# EAGLE design VFD-IV-25-5x7x2_t2 (EAGLE 7.2.0)
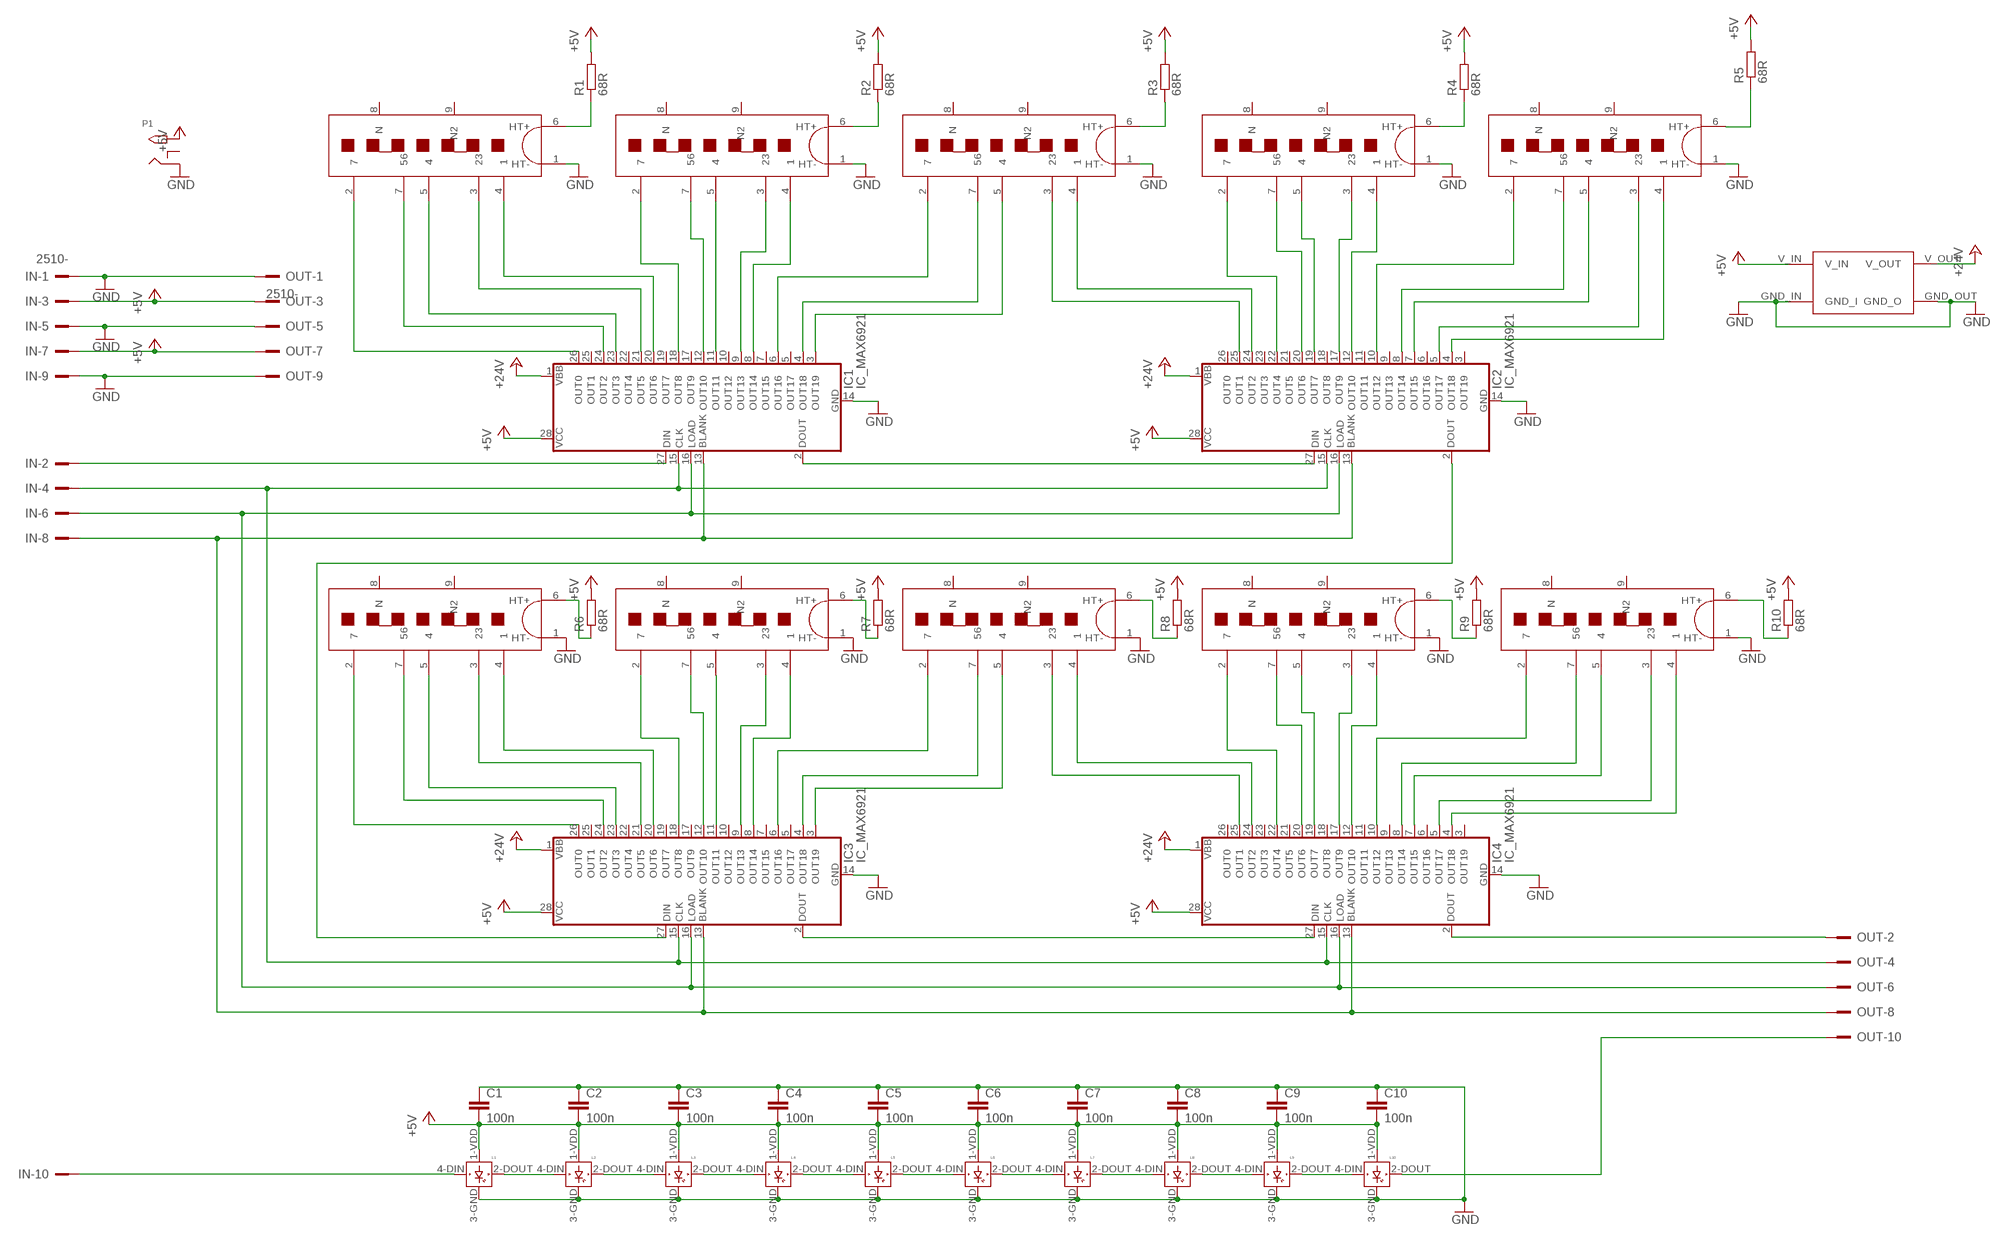
[diagram p0: schematic, sheet 1]

## Parts
1  IV-25_DISP_T3  [IV-25]
2  IV-25_DISP_T3  [IV-25]
3  IV-25_DISP_T3  [IV-25]
4  IV-25_DISP_T3  [IV-25]
5  IV-25_DISP_T3  [IV-25]
6  IV-25_DISP_T3  [IV-25]
7  IV-25_DISP_T3  [IV-25]
8  IV-25_DISP_T3  [IV-25]
9  IV-25_DISP_T3  [IV-25]
10  IV-25_DISP_T3  [IV-25]
C1  100n  C-EU050-025X075  [C050-025X075]
C2  100n  C-EU050-025X075  [C050-025X075]
C3  100n  C-EU050-025X075  [C050-025X075]
C4  100n  C-EU050-025X075  [C050-025X075]
C5  100n  C-EU050-025X075  [C050-025X075]
C6  100n  C-EU050-025X075  [C050-025X075]
C7  100n  C-EU050-025X075  [C050-025X075]
C8  100n  C-EU050-025X075  [C050-025X075]
C9  100n  C-EU050-025X075  [C050-025X075]
C10  100n  C-EU050-025X075  [C050-025X075]
IC1  IC_MAX6921  [S28]
IC2  IC_MAX6921  [S28]
IC3  IC_MAX6921  [S28]
IC4  IC_MAX6921  [S28]
IN  2510-  [PAK100/2500-10]
L1  WS2812B  [WS2812B]
L2  WS2812B  [WS2812B]
L3  WS2812B  [WS2812B]
L4  WS2812B  [WS2812B]
L5  WS2812B  [WS2812B]
L6  WS2812B  [WS2812B]
L7  WS2812B  [WS2812B]
L8  WS2812B  [WS2812B]
L9  WS2812B  [WS2812B]
L10  WS2812B  [WS2812B]
OUT  2510-  [PAK100/2500-10]
P1  2.1MMJACKTHM  [PJ-102A]
R1  68R  R-EU_0207/10  [0207/10]
R2  68R  R-EU_0207/10  [0207/10]
R3  68R  R-EU_0207/10  [0207/10]
R4  68R  R-EU_0207/10  [0207/10]
R5  68R  R-EU_0207/10  [0207/10]
R6  68R  R-EU_0207/10  [0207/10]
R7  68R  R-EU_0207/10  [0207/10]
R8  68R  R-EU_0207/10  [0207/10]
R9  68R  R-EU_0207/10  [0207/10]
R10  68R  R-EU_0207/10  [0207/10]
U$11  STEP_UP_MODULE  [STEP_UP_MODULE]

## Nets
+5V [power]: C1.2 C2.2 C3.2 C4.2 C5.2 C6.2 C7.2 C8.2 C9.2 C10.2 IC1.28(VCC) IC2.28(VCC) IC3.28(VCC) IC4.28(VCC) IN.3 IN.7 L1.1-VDD(VDD) L2.1-VDD(VDD) L3.1-VDD(VDD) L4.1-VDD(VDD) L5.1-VDD(VDD) L6.1-VDD(VDD) L7.1-VDD(VDD) L8.1-VDD(VDD) L9.1-VDD(VDD) L10.1-VDD(VDD) OUT.3 OUT.7 P1.TIP R1.2 R2.2 R3.2 R4.2 R5.2 R6.2 R7.2 R8.2 R9.2 R10.2 U$11.V_IN
+24V [power_lo]: IC1.1(VBB) IC2.1(VBB) IC3.1(VBB) IC4.1(VBB) U$11.V_OUT
GND [power]: 1.1(HT-) 2.1(HT-) 3.1(HT-) 4.1(HT-) 5.1(HT-) 6.1(HT-) 7.1(HT-) 8.1(HT-) 9.1(HT-) 10.1(HT-) C1.1 C2.1 C3.1 C4.1 C5.1 C6.1 C7.1 C8.1 C9.1 C10.1 IC1.14(GND) IC2.14(GND) IC3.14(GND) IC4.14(GND) IN.1 IN.5 IN.9 L1.3-GND(GND) L2.3-GND(GND) L3.3-GND(GND) L4.3-GND(GND) L5.3-GND(GND) L6.3-GND(GND) L7.3-GND(GND) L8.3-GND(GND) L9.3-GND(GND) L10.3-GND(GND) OUT.1 OUT.5 OUT.9 P1.RING U$11.GND_IN(GND_I) U$11.GND_OUT(GND_O)
N$1: L1.2-DOUT(DOUT) L2.4-DIN(DIN)
N$2: L2.2-DOUT(DOUT) L3.4-DIN(DIN)
N$3: L3.2-DOUT(DOUT) L4.4-DIN(DIN)
N$4: L4.2-DOUT(DOUT) L5.4-DIN(DIN)
N$5: L5.2-DOUT(DOUT) L6.4-DIN(DIN)
N$6: L6.2-DOUT(DOUT) L7.4-DIN(DIN)
N$7: L7.2-DOUT(DOUT) L8.4-DIN(DIN)
N$8: L8.2-DOUT(DOUT) L9.4-DIN(DIN)
N$9: L9.2-DOUT(DOUT) L10.4-DIN(DIN)
N$10: 1.2 IC1.26(OUT0)
N$12: 1.7 IC1.24(OUT2)
N$13: 1.5 IC1.23(OUT3)
N$15: 1.3 IC1.21(OUT5)
N$16: 1.4 IC1.20(OUT6)
N$17: 2.2 IC1.18(OUT8)
N$19: 2.7 IC1.12(OUT10)
N$20: 2.5 IC1.11(OUT11)
N$22: 2.3 IC1.9(OUT13)
N$23: 2.4 IC1.8(OUT14)
N$24: 3.2 IC1.6(OUT16)
N$26: 4.2 IC2.22(OUT4)
N$28: 3.7 IC1.4(OUT18)
N$29: 3.5 IC1.3(OUT19)
N$31: 3.3 IC2.25(OUT1)
N$32: 3.4 IC2.24(OUT2)
N$33: 4.7 IC2.20(OUT6)
N$34: 4.5 IC2.19(OUT7)
N$36: 4.3 IC2.17(OUT9)
N$37: 4.4 IC2.12(OUT10)
N$38: 5.2 IC2.10(OUT12)
N$40: 5.7 IC2.8(OUT14)
N$41: 5.5 IC2.7(OUT15)
N$43: 5.3 IC2.5(OUT17)
N$44: 5.4 IC2.4(OUT18)
N$45: 6.2 IC3.26(OUT0)
N$47: 6.7 IC3.24(OUT2)
N$48: 6.5 IC3.23(OUT3)
N$50: 6.3 IC3.21(OUT5)
N$51: 6.4 IC3.20(OUT6)
N$52: 7.2 IC3.18(OUT8)
N$54: 7.7 IC3.12(OUT10)
N$55: 7.5 IC3.11(OUT11)
N$57: 7.3 IC3.9(OUT13)
N$58: 7.4 IC3.8(OUT14)
N$59: 8.2 IC3.6(OUT16)
N$61: 8.7 IC3.4(OUT18)
N$62: 8.5 IC3.3(OUT19)
N$64: 8.3 IC4.25(OUT1)
N$65: 8.4 IC4.24(OUT2)
N$66: 9.2 IC4.22(OUT4)
N$68: 9.7 IC4.20(OUT6)
N$69: 9.5 IC4.19(OUT7)
N$71: 9.3 IC4.17(OUT9)
N$72: 9.4 IC4.12(OUT10)
N$73: 10.2 IC4.10(OUT12)
N$75: 10.7 IC4.8(OUT14)
N$76: 10.5 IC4.7(OUT15)
N$78: 10.3 IC4.5(OUT17)
N$79: 10.4 IC4.4(OUT18)
N$80: IC1.2(DOUT) IC2.27(DIN)
N$81: IC2.2(DOUT) IC3.27(DIN)
N$82: IC3.2(DOUT) IC4.27(DIN)
N$83: IC1.27(DIN) IN.2
N$84: IN.10 L1.4-DIN(DIN)
N$85: L10.2-DOUT(DOUT) OUT.10
N$86: IC4.2(DOUT) OUT.2
N$87: IC1.15(CLK) IC2.15(CLK) IC3.15(CLK) IC4.15(CLK) IN.4 OUT.4
N$88: IC1.16(LOAD) IC2.16(LOAD) IC3.16(LOAD) IC4.16(LOAD) IN.6 OUT.6
N$89 [power_lo]: 5.6(HT+) R5.1
N$90: IC1.13(BLANK) IC2.13(BLANK) IC3.13(BLANK) IC4.13(BLANK) IN.8 OUT.8
N$91 [power_lo]: 4.6(HT+) R4.1
N$92 [power_lo]: 3.6(HT+) R3.1
N$93 [power_lo]: 2.6(HT+) R2.1
N$94 [power_lo]: 1.6(HT+) R1.1
N$95 [power_lo]: 9.6(HT+) R9.1
N$96 [power_lo]: 10.6(HT+) R10.1
N$97 [power_lo]: 8.6(HT+) R8.1
N$98 [power_lo]: 7.6(HT+) R7.1
N$99 [power_lo]: 6.6(HT+) R6.1
Unconnected: 1.8(N) 1.9(N2) 2.8(N) 2.9(N2) 3.8(N) 3.9(N2) 4.8(N) 4.9(N2) 5.8(N) 5.9(N2) 6.8(N) 6.9(N2) 7.8(N) 7.9(N2) 8.8(N) 8.9(N2) 9.8(N) 9.9(N2) 10.8(N) 10.9(N2) IC1.5(OUT17) IC1.7(OUT15) IC1.10(OUT12) IC1.17(OUT9) IC1.19(OUT7) IC1.22(OUT4) IC1.25(OUT1) IC2.3(OUT19) IC2.6(OUT16) IC2.9(OUT13) IC2.11(OUT11) IC2.18(OUT8) IC2.21(OUT5) IC2.23(OUT3) IC2.26(OUT0) IC3.5(OUT17) IC3.7(OUT15) IC3.10(OUT12) IC3.17(OUT9) IC3.19(OUT7) IC3.22(OUT4) IC3.25(OUT1) IC4.3(OUT19) IC4.6(OUT16) IC4.9(OUT13) IC4.11(OUT11) IC4.18(OUT8) IC4.21(OUT5) IC4.23(OUT3) IC4.26(OUT0) P1.RING_SW

## Library data of the parts
1-10 = vfd:IV-25_DISP_T3
C1-C10 = resistor:C-EU: CAPACITOR, European symbol
IC1-IC4 = rob:IC_MAX6921: 20-outputs, 76V, serial VFD driver Dangerousprototypes.com
IN OUT = con-3m:2510-: 3M (TM) Pak 100 4-Wall Header Source: 3M; MF: 3M; MPN: 2510-6002UB; OC_FARNELL: 9838244; OC_NEWARK: 46F4725
L1-L10 = adafruit:WS2812B
P1 = adafruit:2.1MMJACK: 2.1mm x 5.5mm THM DC jack with internal switch. Digikey part #PJ-102A, 4UCON part #05537 2.1mm x 5.5mm SMT DC jack with internal switch. Digikey part #PJ-002A-SMT, 4UCON part #03267 By microbuilder.eu & adafruit.com
R1-R10 = resistor:R-EU_: RESISTOR, European symbol
U$11 = vfd:STEP_UP_MODULE

## Net classes
1 power: width 1 mm
2 power_lo: width 0.5 mm

## Board
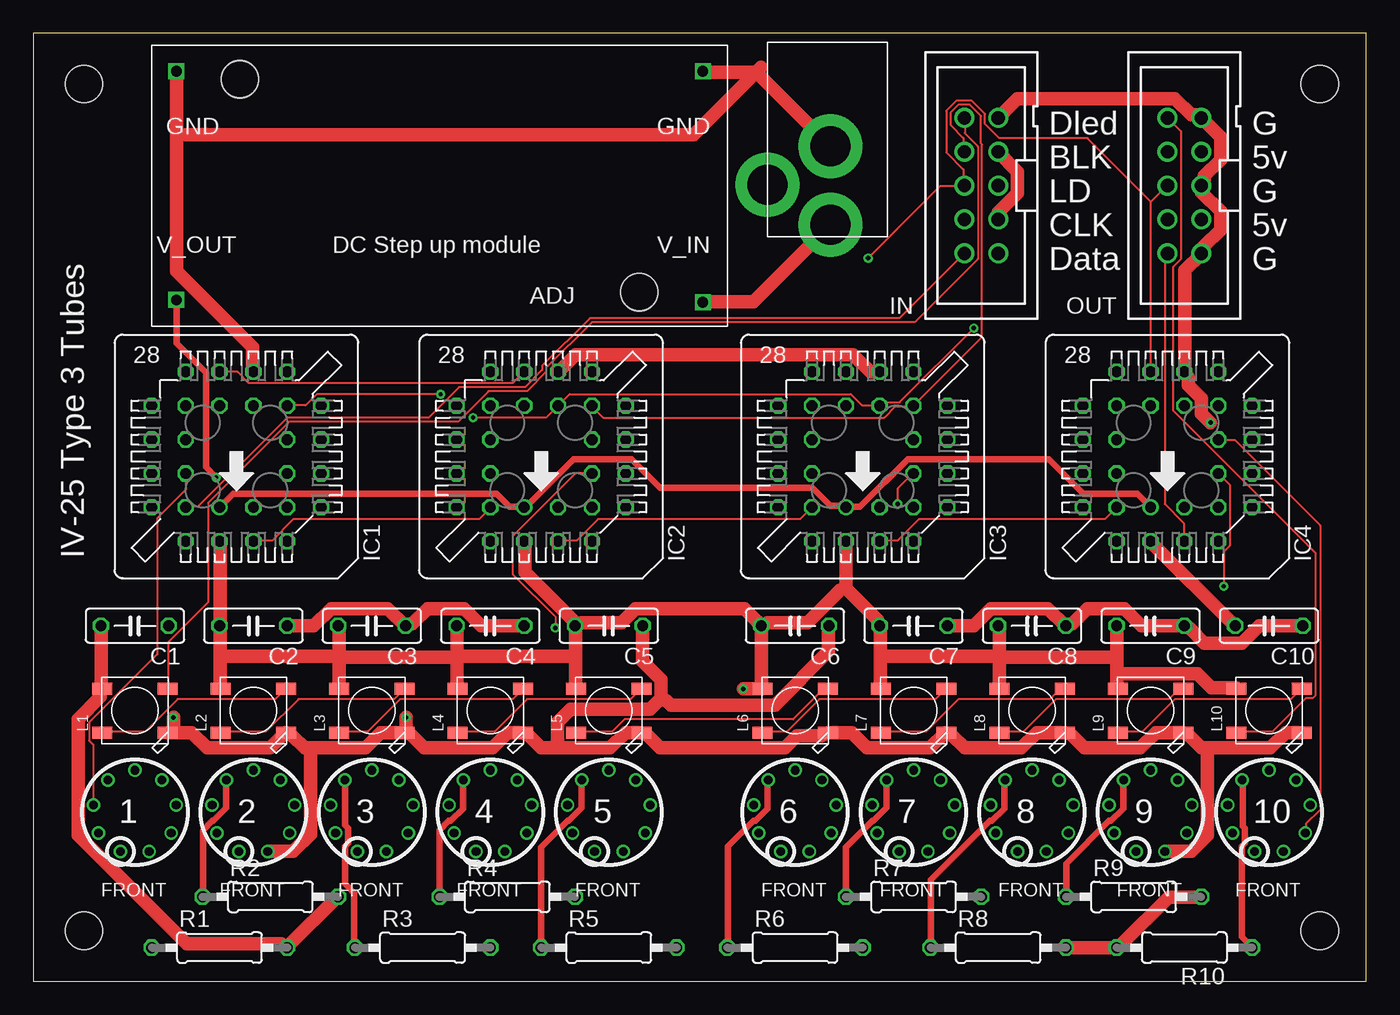
[diagram p1: board, top side]
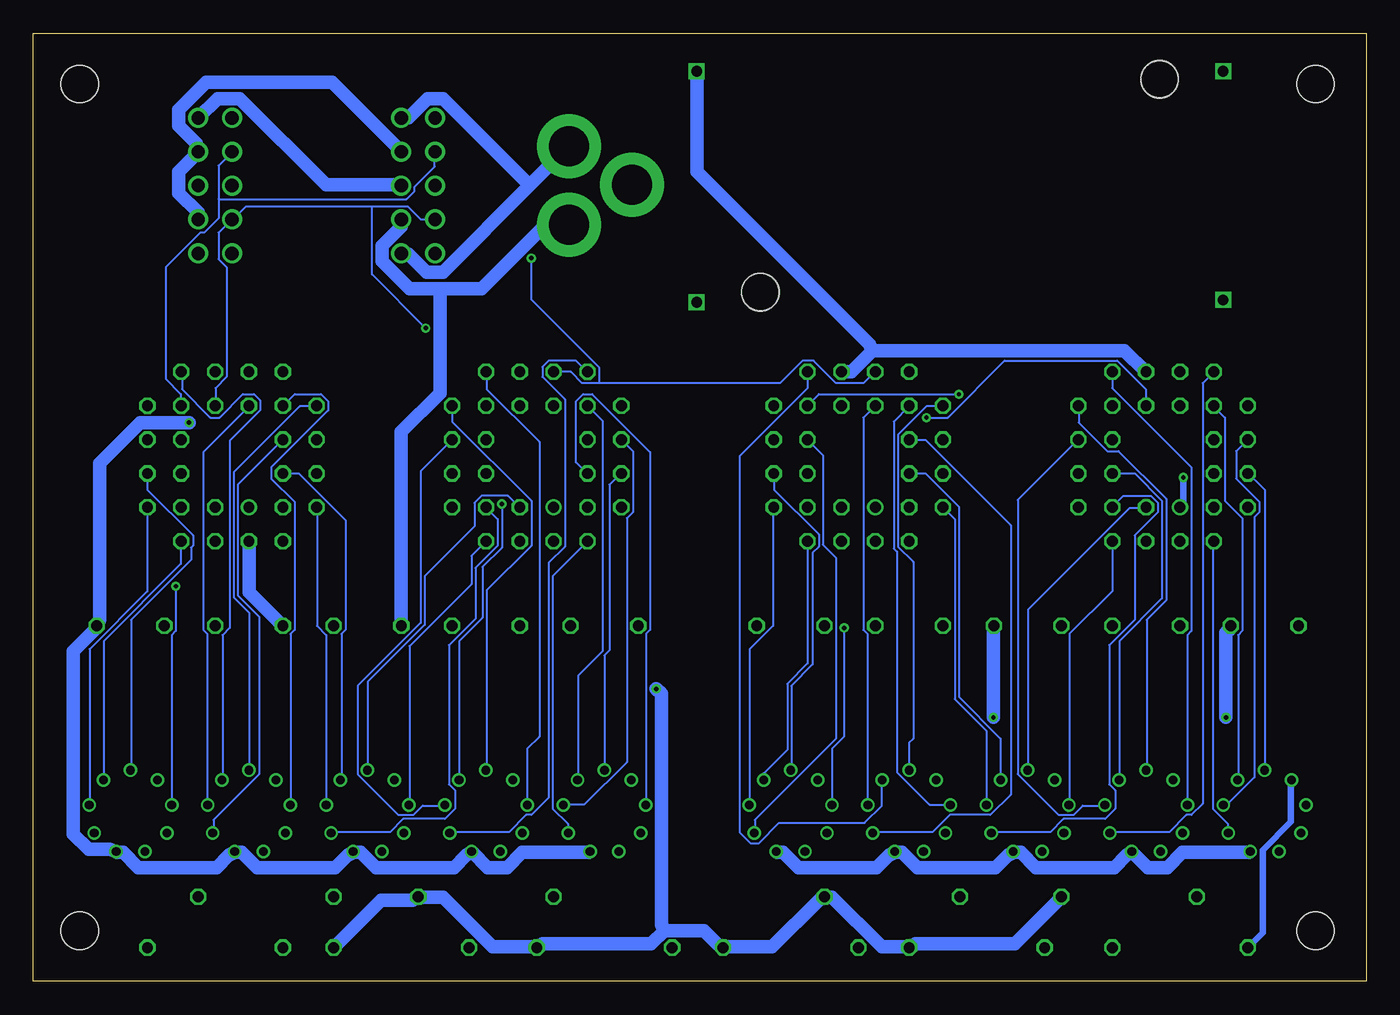
[diagram p2: board, bottom side, seen from below]

Size 100 x 71.11 mm. Coordinates in mm from the lower left corner, seen from the top.
Outline: 0,0 100,0 100,71.11 0,71.11 0,0
Copper layers (1*16): Top 0.0356mm / dielectric 1.5011mm / Bottom 0.0356mm
Design rules "oshpark-2layer": minimum track width 6mil, minimum drill 13mil, track to track 6mil, track to pad 6mil, pad to pad 6mil, via to via 6mil, smd to smd 6mil, copper to edge 15mil, drill to drill 6mil, minimum pad ring 7mil, minimum via ring 7mil, stop-mask expansion 4mil, vias tented up to drill 0mil, thermal gap 10mil
Holes 2.8 mm at 45.45,51.7 3.81,67.31 15.49,67.66 96.52,67.31 96.52,3.81 3.81,3.81

### Footprints (pad centres in the part's own frame; a part is rotated, then mirrored left to right if it is on the bottom)
IV-25 = drill 0.65: 1 1.076,-2.955; 2 2.724,-1.572; 3 3.097,0.546; 4 2.022,2.409; 5 0,3.145; 6 -2.022,2.409; 7 -3.097,0.546; 8 -2.724,-1.572; 9 -1.076,-2.955
C050-025X075 = drill 0.813 octagon: 1 -2.54,0; 2 2.54,0
S28 = drill 0.813: 1 1.27,3.81 | drill 0.813 octagon: 2 -1.27,6.35; 3 -1.27,3.81; 4 -3.81,6.35; 5 -6.35,3.81; 6 -3.81,3.81; 7 -6.35,1.27; 8 -3.81,1.27; 9 -6.35,-1.27; 10 -3.81,-1.27; 11 -6.35,-3.81; 12 -3.81,-6.35; 13 -3.81,-3.81; 14 -1.27,-6.35; 15 -1.27,-3.81; 16 1.27,-6.35; 17 1.27,-3.81; 18 3.81,-6.35; 19 6.35,-3.81; 20 3.81,-3.81; 21 6.35,-1.27; 22 3.81,-1.27; 23 6.35,1.27; 24 3.81,1.27; 25 6.35,3.81; 26 3.81,6.35; 27 3.81,3.81; 28 1.27,6.35
PAK100/2500-10 = drill 1 pad 1.422: 1 -5.08,-1.27; 2 -5.08,1.27; 3 -2.54,-1.27; 4 -2.54,1.27; 5 0,-1.27; 6 0,1.27; 7 2.54,-1.27; 8 2.54,1.27; 9 5.08,-1.27; 10 5.08,1.27
WS2812B = smd 1.5 x 0.9: 1-VDD 2.45,-1.65; 2-DOUT 2.45,1.65; 3-GND -2.45,1.65; 4-DIN -2.45,-1.65
PJ-102A = drill 3 pad 4.8: RING 0.1,-3.39; RING_SW -4.6,-6.29; TIP 0.1,-9.29
0207/10 = drill 0.813 octagon: 1 -5.08,0; 2 5.08,0
STEP_UP_MODULE = drill 0.8 square: GND_IN -19.749,-8.573; GND_OUT 19.749,-8.573; V_IN -19.749,8.753; V_OUT 19.749,8.573 | hole 2.8: -14.986,8.001; 14.986,-8.001

### Placement (x,y rotation side)
1  7.62,12.7 0 top
2  16.51,12.7 0 top
3  25.4,12.7 0 top
4  34.29,12.7 0 top
5  43.18,12.7 0 top
6  57.15,12.7 0 top
7  66.04,12.7 0 top
8  74.93,12.7 0 top
9  83.82,12.7 0 top
10  92.71,12.7 0 top
C1  7.62,26.67 180 top
C2  16.51,26.67 180 top
C3  25.4,26.67 180 top
C4  34.29,26.67 180 top
C5  43.18,26.67 180 top
C6  57.15,26.67 180 top
C7  66.04,26.67 180 top
C8  74.93,26.67 180 top
C9  83.82,26.67 180 top
C10  92.71,26.67 180 top
IC1  15.24,39.37 180 top
IC2  38.1,39.37 180 top
IC3  62.23,39.37 180 top
IC4  85.09,39.37 180 top
IN  71.12,59.69 90 top
L1  7.62,20.32 180 top
L2  16.51,20.32 180 top
L3  25.4,20.32 180 top
L4  34.29,20.32 180 top
L5  43.18,20.32 180 top
L6  57.15,20.32 180 top
L7  66.04,20.32 180 top
L8  74.93,20.32 180 top
L9  83.82,20.32 180 top
L10  92.71,20.32 180 top
OUT  86.36,59.69 90 top
P1  59.69,66.04 0 top
R1  13.97,2.54 0 top
R2  17.78,6.35 0 top
R3  29.21,2.54 0 top
R4  35.56,6.35 0 top
R5  43.18,2.54 0 top
R6  57.15,2.54 0 top
R7  66.04,6.35 0 top
R8  72.39,2.54 0 top
R9  82.55,6.35 0 top
R10  86.36,2.54 180 top
U$11  30.48,59.69 180 top

### Tracks (layer width: path | path; a pad name or v marks a point on that pad's centre or on a via)
+5V  (via drill 0.33)
  Top 1: R8.2 77.5,2.52 81.23,2.52 R10.2 81.69,2.82 85.19,6.33 87.63,6.33 R9.2 | C1.2 5.11,26.67 5.11,22.02 L1.1-VDD 5.03,21.49 5.03,21.34 3.35,19.66 3.35,10.97 11.51,2.82 18.59,2.82 R1.2 19.05,2.59 22.86,6.4 R2.2 | IN.3 72.39,57.68 73.84,59.13 73.84,60.73 72.39,62.18 IN.7 | U$11.V_IN 50.29,50.98 54.03,50.98 59.74,56.69 P1.TIP | 40.69,24.38 40.69,26.67 C5.2 | 40.69,24.38 40.69,22.02 L5.1-VDD | IC2.28 36.88,32.99 36.88,30.71 40.46,27.13 C5.2 | 14.02,24.38 14.02,26.67 C2.2 14.02,27.13 14.02,32.99 IC1.28 | 14.02,24.38 14.02,22.02 L2.1-VDD | 22.94,24.38 22.94,26.59 C3.2 | 22.94,24.38 22.94,24.31 | 22.94,24.31 22.94,22.02 L3.1-VDD | 31.77,24.38 31.77,26.67 C4.2 | 31.77,24.38 31.77,24.31 | 31.77,24.31 31.77,22.02 L4.1-VDD | 31.77,24.31 22.94,24.31 | 22.94,24.38 14.02,24.38 | 31.77,24.38 40.69,24.38 | C6.2 54.63,26.67 54.63,22.02 L6.1-VDD 54.18,21.95 v53.26,21.95 | 63.55,24.38 63.55,26.67 C7.2 63.32,27.13 60.96,29.49 | 63.55,24.38 63.55,22.02 L7.1-VDD | 60.96,29.49 IC3.28 | C6.2 55.09,26.9 58.06,26.9 60.5,29.34 60.96,29.49 | 72.47,24.38 72.47,26.59 C8.2 | 72.47,24.38 72.47,24.31 | 72.47,24.31 72.47,22.02 L8.1-VDD | 81.31,24.31 81.31,26.67 C9.2 | 81.31,24.31 81.31,23.09 | 81.31,23.09 81.31,22.02 L9.1-VDD | 81.31,23.09 87.33,23.09 88.39,22.02 90.22,22.02 L10.1-VDD | C10.2 90.14,26.67 83.82,32.99 IC4.28 | 81.31,24.31 72.47,24.31 | 72.47,24.38 63.55,24.38 | C5.2 41.15,26.9 44.12,26.9 45.19,27.96 53.34,27.96 54.25,27.05 C6.2
  Bottom 1: R8.2 73.91,6.1 71.55,6.1 R7.2 71.09,6.33 69.27,6.33 65.53,2.59 62.26,2.59 R6.2 61.8,2.82 53.65,2.82 52.65,3.81 | R2.2 22.86,6.33 26.36,2.82 33.83,2.82 R3.2 34.29,2.59 36.35,2.59 40.08,6.33 40.62,6.33 R4.2 41.07,6.1 44.58,2.59 48.23,2.59 R5.2 48.69,2.82 49.68,3.81 52.65,3.81 | OUT.3 87.63,57.68 89.08,59.13 89.08,60.73 87.63,62.18 OUT.7 87.78,62.71 87.78,62.87 89.08,64.16 89.08,65.38 87.02,67.44 77.57,67.44 72.39,62.26 IN.7 | IN.3 72.39,56.62 73.84,55.17 73.84,54.03 71.78,51.97 69.49,51.97 | 69.49,51.97 66.37,51.97 61.65,56.69 59.82,56.69 P1.TIP | IC4.28 83.82,29.18 81.31,26.67 C9.2 | 69.49,51.97 69.49,44.12 72.39,41.22 C8.2 | v53.26,21.95 52.88,21.57 52.88,4.27 52.65,3.81
+24V  (via drill 0.33)
  Top 0.5: IC4.1 83.82,35.59 82.83,36.58 78.79,36.58 76.2,39.17 65.61,39.17 62.03,35.59 60.96,35.59 IC3.1 60.73,35.66 59.82,35.66 58.45,37.03 47.02,37.03 44.88,39.17 40.54,39.17 37.03,35.66 IC2.1 36.8,35.59 35.74,35.59 34.75,36.58 15.01,36.58 14.02,35.59 IC1.1 | v13.72,37.8 12.95,38.56 12.95,45.64 10.74,47.85 10.74,51.05 U$11.V_OUT
  Bottom 0.5: v13.72,37.8 13.72,35.81 IC1.1
GND  (via drill 0.33)
  Top 1: U$11.GND_IN 50.29,68.2 54.25,68.2 59.74,62.71 P1.RING | IN.9 73.84,66.22 85.65,66.22 86.87,65 87.17,65 OUT.9 89.08,63.32 89.08,61.65 87.86,60.43 87.86,60.12 OUT.5 87.63,59.21 89.08,57.76 89.08,56.39 87.78,55.09 OUT.1 87.63,54.56 86.41,53.34 86.41,45.72 IC4.14 86.64,45.26 86.64,44.73 87.63,43.74 87.63,42.6 v88.32,41.91 | U$11.GND_OUT 10.74,68.2 10.74,53.26 16.46,47.55 16.46,45.72 IC1.14 | IC3.14 62.79,45.72 61.49,47.02 40.69,47.02 39.4,45.72 IC2.14 | 88.09,17.53 87.63,17.53 86.72,18.44 L9.3-GND 86.26,18.67 84.2,18.67 83.06,17.53 78.87,17.53 77.88,18.52 L8.3-GND 77.34,18.67 75.29,18.67 74.14,17.53 69.88,17.53 68.96,18.44 L7.3-GND 68.43,18.67 67.28,17.53 62.56,17.53 61.42,18.67 59.66,18.67 L6.3-GND 59.13,18.44 57.3,18.44 56.39,17.53 47.02,17.53 46.1,18.44 L5.3-GND 45.57,18.67 44.42,18.67 43.28,17.53 39.32,17.53 | 88.09,17.53 92.81,17.53 93.95,18.67 95.1,18.67 L10.3-GND | C7.1 70.56,26.67 71.86,27.96 76.12,27.96 77.42,26.67 C8.1 77.95,26.82 79.1,27.96 81.84,27.96 83.13,26.67 C9.1 86.79,26.44 87.86,25.38 90.68,25.38 91.97,26.67 C10.1 | 88.09,17.53 88.09,10.97 86.87,9.75 84.96,9.75 9.1 | C2.1 21.03,26.67 22.33,27.96 26.59,27.96 27.89,26.67 C3.1 28.42,26.82 29.57,27.96 32.31,27.96 33.6,26.67 C4.1 | 10.52,18.67 11.89,18.67 13.03,17.53 17.75,17.53 18.9,18.67 L2.3-GND 19.43,18.44 20.34,17.53 20.8,17.53 | 10.52,18.67 10.13,18.67 L1.3-GND | 27.81,18.67 26.06,18.67 24.92,17.53 20.8,17.53 | 27.81,18.67 L3.3-GND 28.35,18.52 29.34,17.53 34.44,17.53 35.59,18.67 36.73,18.67 L4.3-GND 37.19,18.44 38.1,17.53 39.32,17.53 | 10.52,18.67 v10.52,19.81
  Top 1: C5.1 45.72,24 47.09,22.63 47.09,21.26 | 47.09,21.26 46.25,20.42 40.31,20.42 39.32,19.43 39.32,17.53 | C6.1 59.66,26.67 59.66,24.77 55.63,20.73 47.85,20.73 47.55,21.03 47.09,21.26 | v27.96,19.81 27.96,19.13 27.81,18.67 | 20.8,17.53 20.8,11.05 19.51,9.75 17.6,9.75 2.1
  Bottom 1: OUT.9 86.18,66.22 84.51,66.22 78.03,59.74 72.39,59.74 IN.5 | 62.75,59.7 59.82,62.64 P1.RING | 62.75,59.7 69.27,53.19 70.48,53.19 71.86,54.56 72.39,54.56 IN.1 | IN.9 71.86,64.77 70.41,66.22 69.27,66.22 62.75,59.7 | IC2.14 38.63,45.72 37.03,47.32 | 37.03,47.32 18.14,47.32 16.54,45.72 IC1.14 | U$11.GND_IN 50.22,68.2 50.22,60.73 37.26,47.78 37.03,47.32 | 6.1 58.29,9.68 63.32,9.68 64.47,8.53 65.91,8.53 67.06,9.68 7.1 67.51,9.45 68.43,8.53 74.3,8.53 75.44,9.68 75.97,9.68 | 75.97,9.68 8.1 | 84.89,9.68 84.35,9.68 83.21,8.53 77.34,8.53 76.43,9.45 75.97,9.68 | 84.89,9.68 9.1 | 84.89,9.68 85.34,9.45 86.26,8.53 92.13,8.53 93.27,9.68 93.73,9.68 10.1 94.26,9.91 95.86,9.91 97,11.05 97,24.77 95.25,26.52 C10.1 95.02,27.13 95.02,38.86 91.97,41.91 v88.32,41.91 | 1.1 8.76,9.68 13.79,9.68 14.94,8.53 16.38,8.53 17.53,9.68 2.1 17.98,9.45 18.9,8.53 24.77,8.53 25.91,9.68 26.44,9.68 | 26.44,9.68 3.1 | 35.36,9.68 34.82,9.68 33.68,8.53 27.81,8.53 26.9,9.45 26.44,9.68 | 35.36,9.68 4.1 | 5.1 44.2,9.68 43.74,9.68 42.6,8.53 36.73,8.53 35.81,9.45 35.36,9.68 | v10.52,19.81 10.52,26.14 10.21,26.44 10.21,26.67 C1.1 | v27.96,19.81 27.96,26.67 C3.1
N$1
  Top 0.152: L1.2-DOUT 5.18,18.75 8.38,18.75 10.82,21.18 18.14,21.18 18.9,21.95 L2.4-DIN
N$2
  Top 0.152: L2.2-DOUT 14.1,18.75 17.45,18.75 19.89,21.18 27.05,21.18 27.81,21.95 L3.4-DIN
N$3
  Top 0.152: L3.2-DOUT 23.01,18.75 25.07,18.75 27.51,21.18 35.97,21.18 36.73,21.95 L4.4-DIN
N$4
  Top 0.152: L4.2-DOUT 31.85,18.75 34.59,18.75 37.03,21.18 44.81,21.18 45.57,21.95 L5.4-DIN
N$5
  Top 0.152: L5.2-DOUT 40.77,18.75 43.43,18.75 44.35,19.66 57,19.66 59.28,21.95 59.59,21.95 L6.4-DIN
N$6
  Top 0.152: L6.2-DOUT 54.71,18.75 56.54,18.75 58.98,21.18 67.67,21.18 68.43,21.95 L7.4-DIN
N$7
  Top 0.152: L7.2-DOUT 63.63,18.75 66.98,18.75 69.42,21.18 76.28,21.18 77.04,21.95 77.34,21.95 L8.4-DIN
N$8
  Top 0.152: L8.2-DOUT 72.54,18.75 74.3,18.75 76.73,21.18 85.19,21.18 85.95,21.95 86.26,21.95 L9.4-DIN
N$9
  Top 0.152: L9.2-DOUT 81.38,18.75 83.21,18.75 85.65,21.18 94.34,21.18 95.1,21.95 L10.4-DIN
N$10
  Bottom 0.152: 1.2 10.36,11.2 10.36,11.81 11.51,12.95 11.51,32.92 11.43,32.99 IC1.26
N$11
  Top 1.016: 11.43,63.5 49.53,63.5 54.61,68.58
N$12
  Top 0.152: IC1.24 11.43,36.88 9.3,34.75 9.3,24.54 4.19,19.43 4.19,18.06 4.5,17.75 4.5,13.26 1.7
N$13
  Bottom 0.152: 1.5 7.62,36.88 8.84,38.1 IC1.23
N$15
  Bottom 0.152: IC1.21 9.75,39.78 9.75,37.72 8,35.97 8,35.2 8.38,34.82 8.38,15.32 10.44,13.26 10.67,13.26 1.3
N$16
  Bottom 0.152: 1.4 9.6,15.16 9.6,25.98 9.3,26.29 9.3,34.75 10.59,36.04 10.59,42.29 11.43,43.13 IC1.20
N$17
  Bottom 0.152: IC1.18 12.27,44.88 12.27,13.34 13.11,12.5 13.49,12.5 14.78,11.2 19.2,11.2 2.2
N$19
  Bottom 0.152: IC1.12 19.05,44.5 13.11,38.56 13.11,26.29 13.41,25.98 2.7
N$20
  Bottom 0.152: 2.5 16.46,15.85 16.46,27.13 15.01,28.57 15.01,36.2 18.59,39.78 19.43,39.78 21.57,41.91 21.57,43.13 IC1.11
N$22
  Bottom 0.152: 2.3 19.66,13.18 21.26,13.18 21.95,12.5 23.09,12.5 26.14,15.54 26.14,36.12 21.64,40.62 IC1.9
N$23
  Bottom 0.152: IC1.8 17.37,38.1 15.32,36.04 15.32,28.73 18.52,25.53 18.52,15.16 2.4
N$24
  Bottom 0.152: 3.2 28.12,11.2 23.7,11.2 22.71,12.19 19.58,12.19 18.82,12.95 18.82,14.33 19.28,14.78 19.28,25.22 17.37,27.13 17.37,33.45 15.62,35.2 15.62,35.89 16.15,36.42 18.21,36.42 19.05,35.59 IC1.6
N$26
  Bottom 0.152: 4.2 36.96,11.2 32.54,11.2 31.24,12.5 28.19,12.5 26.67,14.02 26.67,34.21 33.07,40.62 34.29,40.62 IC2.22
N$28
  Bottom 0.152: IC1.4 19.05,29.26 22.25,26.06 22.25,13.26 3.7
N$29
  Bottom 0.152: 3.5 25.38,15.85 25.38,27.89 17.75,35.51 16.54,35.51 IC1.3
N$31
  Bottom 0.152: IC2.25 30.86,34.67 30.86,21.18 28.5,18.82 3.3
N$32
  Bottom 0.152: IC2.24 33.07,38.1 30.56,35.59 30.56,21.34 27.43,18.21 27.43,15.16 3.4
N$33
  Bottom 0.152: 4.7 31.24,13.26 32.77,13.26 35.2,15.7 35.2,32.23 35.43,32.46 35.43,41.99 34.29,43.13 IC2.20
N$34
  Bottom 0.152: 4.5 34.29,17.91 33.98,18.21 33.98,31.47 35.13,32.61 35.13,41 32.99,43.13 31.77,43.13 IC2.19
N$36
  Bottom 0.152: IC2.17 37.72,42.29 37.72,26.36 37.41,26.06 37.41,13.26 4.3
N$37
  Bottom 0.152: IC2.12 41.91,44.5 47.02,39.4 47.02,11.2 46.18,10.36 45.57,10.36 44.04,11.89 37.64,11.89 36.35,13.18 36.35,15.09 4.4
N$38
  Bottom 0.152: 5.2 45.87,11.2 45.87,12.12 39.78,18.21 39.78,31.77 40.77,32.77 40.77,39.47 41.91,40.62 IC2.10
N$40  (via drill 0.33)
  Top 0.152: v39.17,26.52 39.17,27.36 35.97,30.56 35.97,33.38 40.69,38.1 IC2.8
  Bottom 0.152: v39.17,26.52 39.17,18.36 40.08,17.45 5.7
N$41
  Bottom 0.152: 5.5 43.13,15.85 43.13,22.17 41.53,23.77 41.53,32.16 41.07,32.61 41.07,33.53 44.42,36.88 44.42,38.1 IC2.7
N$43
  Bottom 0.152: 5.3 46.25,13.26 46.25,24.92 44.5,26.67 44.5,35.51 IC2.5
N$44
  Bottom 0.152: IC2.4 41.91,23.85 43.43,22.33 43.43,17.37 45.19,15.62 45.19,15.16 5.4
N$45
  Bottom 0.152: IC3.26 61.04,30.4 61.04,12.95 59.89,11.81 59.89,11.2 6.2
N$47
  Bottom 0.152: 6.7 54.03,13.26 54.03,26.06 53.72,26.36 53.72,39.7 58.06,44.04 58.75,44.04 59.28,43.51 59.28,38.94 58.45,38.1 IC3.24
N$48
  Bottom 0.152: 6.5 57.15,24.46 56.77,24.84 56.77,37.26 55.93,38.1 IC3.23
N$50
  Bottom 0.152: IC3.21 55.02,39.78 55.02,35.2 55.47,34.75 55.47,16.46 58.67,13.26 60.2,13.26 6.3
N$51
  Bottom 0.152: IC3.20 57.3,42.06 57.3,24.77 59.13,22.94 59.13,15.16 6.4
N$52
  Bottom 0.152: 7.2 68.73,11.2 64.31,11.2 63.02,12.5 62.64,12.5 61.34,13.79 61.34,31.39 60.12,32.61 60.12,43.66 61.8,45.34 61.8,46.1 61.34,46.56 59.28,46.56 58.45,45.72 IC3.18
N$54
  Bottom 0.152: 7.7 62.94,17.45 62.03,18.36 62.03,40.46 65.99,44.42 65.99,45.72 IC3.12
N$55
  Bottom 0.152: IC3.11 68.58,41.99 62.64,36.04 62.64,32.69 65.99,29.34 65.99,15.85 7.5
N$57
  Bottom 0.152: 7.3 69.19,13.18 70.79,13.18 71.48,12.5 72.62,12.5 75.67,15.54 75.67,22.17 70.94,26.9 70.94,38.25 68.58,40.62 IC3.9
N$58  (via drill 0.33)
  Top 0.152: v64.85,35.81 64.85,36.96 65.99,38.1 IC3.8
  Bottom 0.152: v64.85,35.81 64.85,32.54 66.29,31.09 66.29,27.28 68.05,25.53 68.05,15.16 7.4
N$59
  Bottom 0.152: IC3.6 65.15,34.67 65.15,32.69 66.83,31.01 66.83,27.2 68.81,25.22 68.81,14.78 68.35,14.33 68.35,12.95 69.11,12.19 72.24,12.19 73.23,11.2 77.65,11.2 8.2
N$61
  Bottom 0.152: IC3.4 67.13,31.93 67.13,29.79 71.78,25.15 71.78,13.26 8.7
N$62
  Bottom 0.152: 8.5 74.91,15.85 74.91,22.48 70.64,26.75 70.64,30.4 66.9,34.14 66.9,35.89 66.37,36.42 64.39,36.42 63.55,35.59 IC3.3
N$64
  Bottom 0.152: 8.3 78.03,25.98 78.72,26.67 78.72,35.51 IC4.25
N$65
  Bottom 0.152: IC4.24 80.09,38.1 76.58,34.59 76.58,26.36 76.89,26.06 76.89,15.16 8.4
N$66
  Bottom 0.152: IC4.22 84.66,37.26 84.66,28.96 83.06,27.36 83.06,15.54 86.49,12.12 86.49,11.2 9.2
N$68
  Bottom 0.152: 9.7 80.7,13.26 80.7,26.06 80.39,26.36 80.39,35.97 82.14,37.72 82.14,38.56 77.88,42.82 77.88,43.51 78.41,44.04 80.39,44.04 81.23,43.2 IC4.20
N$69
  Bottom 0.152: 9.5 83.82,27.66 84.96,28.8 84.96,38.18 80.01,43.13 78.79,43.13 IC4.19
N$71
  Bottom 0.152: 9.3 86.94,13.26 86.94,26.06 87.25,26.36 87.25,39.7 83.82,43.13 IC4.17
N$72
  Bottom 0.152: 9.4 85.8,15.16 85.8,25.98 85.27,26.52 85.27,40.54 82.98,42.82 82.98,43.59 83.44,44.04 84.28,44.04 86.03,42.29 86.72,42.29 88.85,44.42 88.85,45.72 IC4.12
N$73
  Top 0.152: 10.2 95.48,11.2 95.48,11.81 96.55,12.88 96.55,34.21 90.14,40.62 88.92,40.62 IC4.10
N$75  (via drill 0.33)
  Top 0.152: v89.31,29.64 89.31,32.23 89.76,32.69 89.76,37.26 88.92,38.1 IC4.8
  Bottom 0.152: v89.31,29.64 89.31,26.29 89.61,25.98 10.7
N$76
  Bottom 0.152: IC4.7 91.44,36.88 88.01,33.45 88.01,32.69 88.16,32.54 88.16,31.62 92.66,27.13 92.66,15.85 10.5
N$78
  Bottom 0.152: IC4.5 91.44,29.26 95.78,24.92 95.78,13.26 10.3
N$79
  Bottom 0.152: 10.4 94.72,15.16 94.72,25.53 88.92,31.32 88.92,32.99 IC4.4
N$80
  Top 0.152: IC1.2 16.54,33.07 17.91,33.07 19.51,34.67 33.45,34.67 34.29,35.51 IC2.27
N$81
  Top 0.152: IC3.27 57.53,34.67 42.37,34.67 40.77,33.07 39.4,33.07 IC2.2
N$82
  Top 0.152: IC4.27 80.39,34.67 66.45,34.67 64.85,33.07 63.55,33.07 IC3.2
N$83
  Top 0.152: IN.2 65,49.76 41.76,49.76 38.18,46.18 38.18,45.87 36.88,44.58 31.93,44.58 29.64,42.29 19.05,42.29 12.34,35.59 11.43,35.59 IC1.27
N$84
  Top 0.152: L1.4-DIN 10.13,22.02 10.13,25.45 13.11,28.42 13.11,35.89 19.2,41.99 31.85,41.99 34.14,44.27 37.03,44.27 38.48,45.72 38.48,46.02 41.91,49.45 66.14,49.45 70.87,54.18 70.87,62.64 69.88,63.63 69.88,64.77 IN.10
N$85
  Top 0.152: L10.2-DOUT 90.3,18.75 92.96,18.75 95.48,21.26 96.01,21.26 96.16,21.41 96.16,32.16 85.5,42.82 85.5,53.57 86.11,54.18 86.11,63.78 85.11,64.77 OUT.10
N$86
  Top 0.152: OUT.2 84.89,54.41 84.89,35.81 86.33,34.37 86.33,33.07 IC4.2
N$87  (via drill 0.33)
  Top 0.152: v32.99,42.29 38.48,42.29 IC2.15 40.23,44.04 61.34,44.04 62.18,43.2 63.48,43.2 IC3.15 63.55,43.2 63.78,43.43 65,43.43 v70.56,49
  Bottom 0.152: IC4.15 86.33,43.2 86.33,44.5 85.5,45.34 85.5,53.57 86.11,54.18 86.11,56.16 85.11,57.15 OUT.4 85.04,57.15 84.05,58.14 74.6,58.14 | IN.4 70.94,57.15 71.93,58.14 74.6,58.14 | v32.99,42.29 31.39,42.29 27.13,46.56 18.67,46.56 16.54,44.42 16.54,43.2 IC1.15 | 74.6,58.14 74.6,53.03 v70.56,49
N$88  (via drill 0.33)
  Top 0.152: IC4.16 83.82,58.45 83.86,58.48 | 83.86,58.48 85.04,59.66 OUT.6 | 83.86,58.48 79.1,63.25 72.47,63.25 71.4,64.31 71.4,65.08 70.41,66.06 69.27,66.06 68.5,65.3 68.5,62.18 69.8,60.88 69.8,59.74 IN.6 69.8,59.66 68.05,59.66 v62.64,54.25 | IC1.16 15.32,45.72 16.15,44.88 35.97,44.88 36.8,45.72 IC2.16
  Bottom 0.152: IC3.16 59.66,45.72 58.83,44.88 57.53,44.88 | 57.53,44.88 43.97,44.88 42.29,46.56 41.45,46.56 39.78,44.88 37.72,44.88 36.88,45.72 IC2.16 | v62.64,54.25 62.64,51.13 57.53,46.02 57.53,44.88
N$89
  Top 0.5: R5.1 38.1,10.06 40.08,12.04 40.16,12.04 41.15,13.03 41.15,15.09 5.6
N$90  (via drill 0.33)
  Top 0.152: v30.56,44.04 21.26,44.04 20.42,43.2 19.05,43.2 IC1.13 | IC2.13 41.91,43.13 42.75,42.29 63.86,42.29 64.69,43.13 65.99,43.13 IC3.13 71.17,48.31 71.17,62.79 71.09,62.87 71.09,64.92 70.26,65.76 69.42,65.76 68.81,65.15 68.81,64.24 69.8,63.25 69.8,62.26 IN.8
  Bottom 0.152: 86.11,58.67 86.11,61.19 85.11,62.18 OUT.8 | 86.11,58.67 86.11,57.23 87.17,56.16 87.48,56.16 90.07,53.57 90.07,45.19 88.92,44.04 88.92,43.2 IC4.13 | 86.11,58.67 72.01,58.67 71.4,59.28 71.4,59.59 69.88,61.11 69.88,62.18 IN.8 | v30.56,44.04 41.07,44.04 41.91,43.2 IC2.13
N$91
  Top 0.5: R4.1 30.48,11.35 31.17,12.04 31.32,12.04 32.23,12.95 32.23,15.09 4.6
N$92
  Top 0.5: 3.6 23.39,15.09 23.39,11.73 23.62,11.51 23.62,10.36 23.39,10.13 23.39,7.32 24.08,6.63 24.08,2.59 R3.1
N$93
  Top 0.5: 2.6 14.48,15.09 14.48,13.03 13.49,12.04 13.41,12.04 12.72,11.35 12.72,6.4 R2.1
N$94
  Bottom 0.5: R1.1 7.77,3.66 7.77,9.83 5.64,11.96 5.64,15.09 1.6
N$95
  Top 0.5: 9.6 81.76,15.09 81.76,12.95 80.85,12.04 80.7,12.04 77.5,8.84 77.5,6.4 R9.1
N$96
  Top 0.5: 10.6 90.75,15.09 90.75,11.66 90.91,11.51 90.91,10.36 90.68,10.13 90.68,3.35 91.44,2.59 R10.1
N$97
  Top 0.5: 8.6 72.85,15.09 72.85,12.95 71.93,12.04 71.78,12.04 67.36,7.62 67.36,2.59 R8.1
N$98
  Top 0.5: R7.1 60.96,10.06 62.94,12.04 63.02,12.04 64.01,13.03 64.01,15.09 7.6
N$99
  Top 0.5: 6.6 55.09,15.09 55.09,12.95 54.18,12.04 54.03,12.04 52.12,10.13 52.12,2.59 R6.1

### Text on the board
tPlace: Dled | G | BLK | 5v | LD | G | CLK | 5v | Data | G | IV-25 Type 3 Tubes